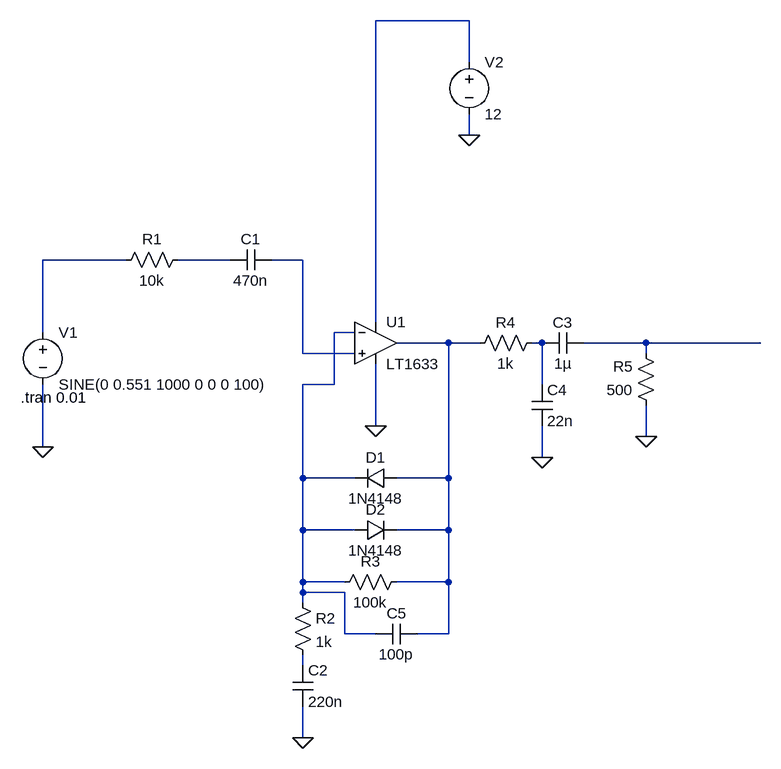
[diagram p0: schematic Distortion.asc]
Distortion.asc, the LTspice schematic file:
Version 4
SHEET 1 1236 740
WIRE 768 -384 624 -384
WIRE 768 -320 768 -384
WIRE 768 -208 768 -240
WIRE 240 -16 112 -16
WIRE 400 -16 320 -16
WIRE 512 -16 464 -16
WIRE 624 80 624 -384
WIRE 112 96 112 -16
WIRE 592 96 560 96
WIRE 736 112 656 112
WIRE 784 112 736 112
WIRE 880 112 864 112
WIRE 1040 112 944 112
WIRE 1216 112 1040 112
WIRE 512 128 512 -16
WIRE 592 128 512 128
WIRE 1040 128 1040 112
WIRE 560 176 560 96
WIRE 560 176 512 176
WIRE 880 176 880 112
WIRE 624 240 624 144
WIRE 1040 256 1040 208
WIRE 112 272 112 176
WIRE 880 288 880 240
WIRE 512 320 512 176
WIRE 592 320 512 320
WIRE 736 320 736 112
WIRE 736 320 656 320
WIRE 512 400 512 320
WIRE 592 400 512 400
WIRE 736 400 736 320
WIRE 736 400 656 400
WIRE 512 480 512 400
WIRE 576 480 512 480
WIRE 736 480 736 400
WIRE 736 480 656 480
WIRE 512 496 512 480
WIRE 576 496 512 496
WIRE 512 512 512 496
WIRE 576 560 576 496
WIRE 624 560 576 560
WIRE 736 560 736 480
WIRE 736 560 688 560
WIRE 512 608 512 592
WIRE 512 720 512 672
FLAG 112 272 0
FLAG 768 -208 0
FLAG 624 240 0
FLAG 512 720 0
FLAG 1040 256 0
FLAG 880 288 0
SYMBOL voltage 112 80 R0
WINDOW 123 0 0 Left 0
WINDOW 39 0 0 Left 0
SYMATTR InstName V1
SYMATTR Value SINE(0 0.551 1000 0 0 0 100)
SYMBOL res 336 -32 R90
WINDOW 0 0 56 VBottom 2
WINDOW 3 32 56 VTop 2
SYMATTR InstName R1
SYMATTR Value 10k
SYMBOL cap 464 -32 R90
WINDOW 0 0 32 VBottom 2
WINDOW 3 32 32 VTop 2
SYMATTR InstName C1
SYMATTR Value 470n
SYMBOL voltage 768 -336 R0
WINDOW 123 0 0 Left 0
WINDOW 39 0 0 Left 0
SYMATTR InstName V2
SYMATTR Value 12
SYMBOL res 496 496 R0
SYMATTR InstName R2
SYMATTR Value 1k
SYMBOL cap 496 608 R0
SYMATTR InstName C2
SYMATTR Value 220n
SYMBOL cap 944 96 R90
WINDOW 0 0 32 VBottom 2
WINDOW 3 32 32 VTop 2
SYMATTR InstName C3
SYMATTR Value 1µ
SYMBOL diode 656 304 R90
WINDOW 0 0 32 VBottom 2
WINDOW 3 32 32 VTop 2
SYMATTR InstName D1
SYMATTR Value 1N4148
SYMBOL diode 592 416 R270
WINDOW 0 32 32 VTop 2
WINDOW 3 0 32 VBottom 2
SYMATTR InstName D2
SYMATTR Value 1N4148
SYMBOL res 672 464 R90
WINDOW 0 0 56 VBottom 2
WINDOW 3 32 56 VTop 2
SYMATTR InstName R3
SYMATTR Value 100k
SYMBOL res 1056 224 R180
WINDOW 0 36 76 Left 2
WINDOW 3 36 40 Left 2
SYMATTR InstName R5
SYMATTR Value 500
SYMBOL OpAmps\\LT1633 624 48 R0
SYMATTR InstName U1
SYMBOL res 880 96 R90
WINDOW 0 0 56 VBottom 2
WINDOW 3 32 56 VTop 2
SYMATTR InstName R4
SYMATTR Value 1k
SYMBOL cap 864 176 R0
SYMATTR InstName C4
SYMATTR Value 22n
SYMBOL cap 688 544 R90
WINDOW 0 0 32 VBottom 2
WINDOW 3 32 32 VTop 2
SYMATTR InstName C5
SYMATTR Value 100p
TEXT 78 196 Left 2 !.tran 0.01

The netlist it stands for:
* Distortion.asc
V1 N002 0 SINE(0 0.551 1000 0 0 0 100)
R1 N003 N002 10k
C1 N004 N003 470n
V2 N001 0 12
R2 N005 N009 1k
C2 N009 0 220n
C3 N008 N007 1µ
D1 N006 N005 1N4148
D2 N005 N006 1N4148
R3 N006 N005 100k
R5 0 N008 500
XU1 N004 N005 N001 0 N006 LT1633  ; pins In+ In- V+ V- OUT
R4 N007 N006 1k
C4 N007 0 22n
C5 N006 N005 100p
.model D D
.lib standard.dio
.tran 0.01
.backanno
.end